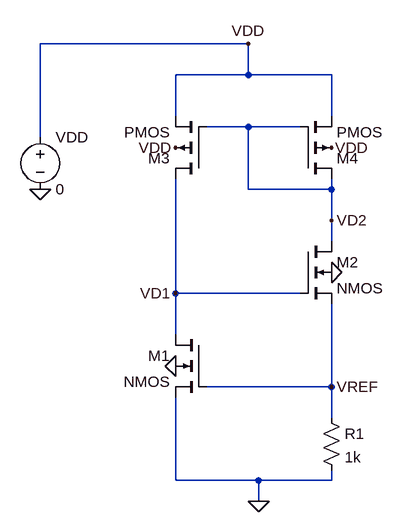
[diagram p0: schematic Chapter03E_07.fig.asc]
Chapter03E_07.fig.asc, the LTspice schematic file:
Version 4
SHEET 1 2940 740
WIRE 192 -368 -128 -368
WIRE 192 -320 192 -368
WIRE 192 -320 80 -320
WIRE 320 -320 192 -320
WIRE 80 -256 80 -320
WIRE 320 -256 320 -320
WIRE 192 -240 128 -240
WIRE 272 -240 192 -240
WIRE -128 -224 -128 -368
WIRE 192 -144 192 -240
WIRE 320 -144 320 -160
WIRE 320 -144 192 -144
WIRE 320 -96 320 -144
WIRE 320 -64 320 -96
WIRE 80 16 80 -160
WIRE 272 16 80 16
WIRE 80 80 80 16
WIRE 320 160 320 32
WIRE 320 160 128 160
WIRE 320 208 320 160
WIRE 80 304 80 176
WIRE 208 304 80 304
WIRE 320 304 320 288
WIRE 320 304 208 304
WIRE 208 336 208 304
FLAG 208 336 0
FLAG -128 -144 0
FLAG 320 -16 0
FLAG 80 128 0
FLAG 192 -368 VDD
FLAG 320 -208 VDD
FLAG 80 -208 VDD
FLAG 80 16 VD1
FLAG 320 -96 VD2
FLAG 320 160 VREF
SYMBOL res 304 192 R0
SYMATTR InstName R1
SYMATTR Value 1k
SYMBOL voltage -128 -240 R0
SYMATTR InstName VDD
SYMATTR Value 0
SYMBOL nmos4 128 80 M0
SYMATTR InstName M1
SYMBOL nmos4 272 -64 R0
SYMATTR InstName M2
SYMBOL pmos4 128 -160 R180
SYMATTR InstName M3
SYMBOL pmos4 272 -160 M180
SYMATTR InstName M4

The netlist it stands for:
* Chapter03E_07.fig.asc
R1 VREF 0 1k
VDD VDD 0 0
M1 VD1 VREF 0 0 NMOS
M2 VD2 VD1 VREF 0 NMOS
M3 VD1 VD2 VDD VDD PMOS
M4 VD2 VD2 VDD VDD PMOS
.model NMOS NMOS
.model PMOS PMOS
.lib standard.mos
.backanno
.end